# Altium schematic sheet ETH.SchDoc: LED Cube 8x8x8 - Ethernet
size A4; Author: Luka Penger; CompanyName: L. Penger; DrawnBy: Luka Penger; Organization: L. Penger; Address1: Luka Penger; Address2: http://lukapenger.eu; Address3: Software & Hardware; Address4: Development; DocumentNumber: 5; Revision: 4.0.0; SheetNumber: 5; SheetTotal: 5; DocumentName: ETH; ProjectName: LED Cube 8x8x8
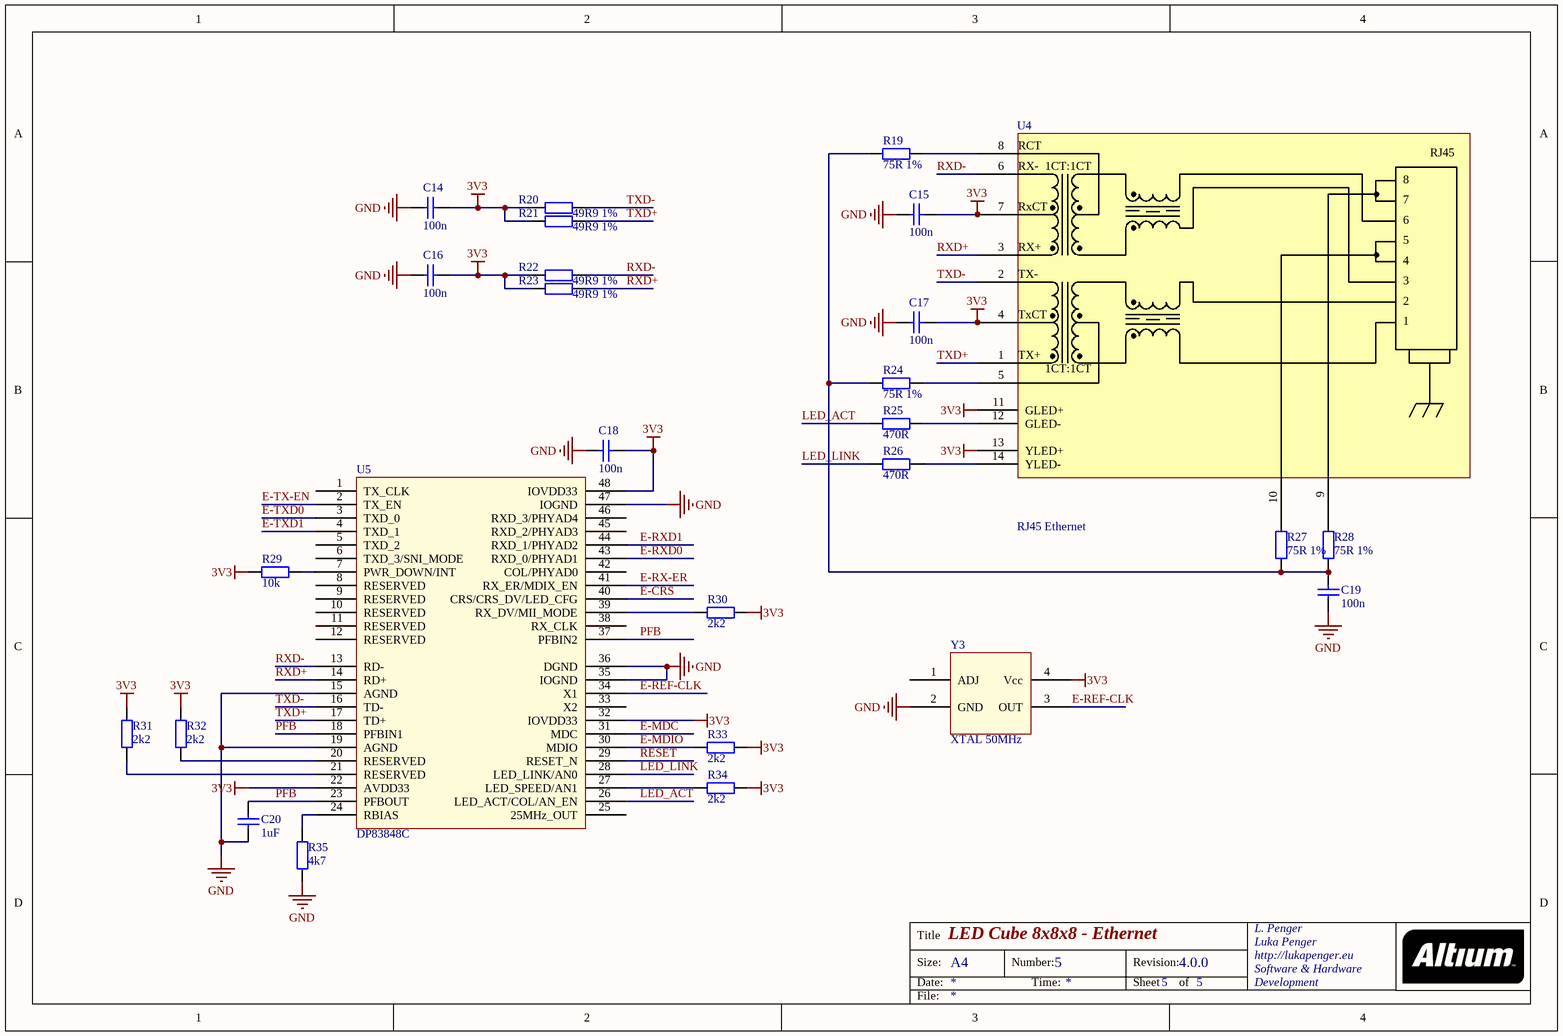
[diagram p0: ETH.SchDoc]

## Parts
C14  100n  [1608[0603]]
C15  100n  [1608[0603]]
C16  100n  [1608[0603]]
C17  100n  [1608[0603]]
C18  100n  [1608[0603]]
C19  100n  [1608[0603]]
C20  1uF  [6-0805_L]
R19  75R 1%  [1608[0603]]
R20  49R9 1%  [1608[0603]]
R21  49R9 1%  [1608[0603]]
R22  49R9 1%  [1608[0603]]
R23  49R9 1%  [1608[0603]]
R24  75R 1%  [1608[0603]]
R25  470R  [1608[0603]]
R26  470R  [1608[0603]]
R27  75R 1%  [1608[0603]]
R28  75R 1%  [1608[0603]]
R29  10k  [1608[0603]]
R30  2k2  [1608[0603]]
R31  2k2  [1608[0603]]
R32  2k2  [1608[0603]]
R33  2k2  [1608[0603]]
R34  2k2  [1608[0603]]
R35  4k7  [1608[0603]]
U4  RJ45 Ethernet  [RJ45 Ethernet connector]
U5  DP83848C  [DP83848C]
Y3  XTAL 50MHz  [XTAL ACT9200]

## Nets
3V3: C14.2 C15.2 C16.2 C17.2 C18.2 R20.2 R21.2 R22.2 R23.2 R29.2 R30.1 R31.1 R32.2 R33.1 R34.1 U4.4 U4.7 U4.11(GLED+) U4.13(YLED+) U5.22(AVDD33) U5.32(IOVDD33) U5.48(IOVDD33) Y3.4(Vcc)
GND: C14.1 C15.1 C16.1 C17.1 C18.1 C19.2 C20.2 R35.2 U5.15(AGND) U5.19(AGND) U5.35(IOGND) U5.36(DGND) U5.47(IOGND) Y3.2(GND)
E-CRS: U5.40(CRS/CRS_DV/LED_CFG)
E-MDC: U5.31(MDC)
E-MDIO: R33.2 U5.30(MDIO)
E-REF-CLK: U5.34(X1) Y3.3(OUT)
E-RX-ER: U5.41(RX_ER/MDIX_EN)
E-RXD0: U5.43(RXD_0/PHYAD1)
E-RXD1: U5.44(RXD_1/PHYAD2)
E-TX-EN: U5.2(TX_EN)
E-TXD0: U5.3(TXD_0)
E-TXD1: U5.4(TXD_1)
LED_ACT: R25.2 U5.26(LED_ACT/COL/AN_EN)
LED_LINK: R26.2 U5.28(LED_LINK/AN0)
PFB: C20.1 U5.18(PFBIN1) U5.23(PFBOUT) U5.37(PFBIN2)
RESET: U5.29(RESET_N)
RXD+: R23.1 U4.3 U5.14(RD+)
RXD-: R22.1 U4.6 U5.13(RD-)
TXD+: R21.1 U4.1 U5.17(TD+)
TXD-: R20.1 U4.2 U5.16(TD-)
NetC19_1: C19.1 R19.2 R24.2 R27.1 R28.1
NetR19_1: R19.1 U4.8
NetR24_1: R24.1 U4.5
NetR25_1: R25.1 U4.12(GLED-)
NetR26_1: R26.1 U4.14(YLED-)
NetR27_2: R27.2 U4.10
NetR28_2: R28.2 U4.9
NetR29_1: R29.1 U5.7(PWR_DOWN/INT)
NetR30_2: R30.2 U5.39(RX_DV/MII_MODE)
NetR31_2: R31.2 U5.21(RESERVED)
NetR32_1: R32.1 U5.20(RESERVED)
NetR34_2: R34.2 U5.27(LED_SPEED/AN1)
NetR35_1: R35.1 U5.24(RBIAS)

Not connected (* = marked no-connect by the designer): U5 1(TX_CLK) 5(TXD_2) 6(TXD_3/SNI_MODE) 8(RESERVED) 9(RESERVED) 10(RESERVED) 11(RESERVED) 12(RESERVED) 25(25MHz_OUT) 33(X2) 38(RX_CLK) 42(COL/PHYAD0) 45(RXD_2/PHYAD3) 46(RXD_3/PHYAD4); Y3 1(ADJ)

## Notes on the sheet
- Title
- Size:
- Date:
- A4
- Number:
- Time:
- Revision:
- Sheet
- of
- File:
- (in symbol RJ45 Ethernet) RCT; RJ45; RX-; 1CT:1CT; RxCT; RX+; TX-; TxCT; TX+

## Library data of the parts
C14-C20 = Cap: Capacitor; Value: 100pF; Published: 8-Jun-2000; LatestRevisionDate: 17-Jul-2002; LatestRevisionNote: Re-released for DXP Platform.; PackageReference: RAD-0.3; Publisher: Altium Limited; PackageDescription: Radial Cap, Thru-Hole; 2 Leads; 0.3 in Pin Spacing
R19-R35 = Res2: Resistor; Value: 1K; Published: 8-Jun-2000; LatestRevisionDate: 17-Jul-2002; LatestRevisionNote: Re-released for DXP Platform.; PackageReference: AXIAL-0.4; Publisher: Altium Limited; PackageDescription: Axial Device, Thru-Hole; 2 Leads; 0.4 in Pin Spacing
U4 = RJ45 Ethernet: Ethernet Connector
U5 = DP83848C: Ethernet PHY
Y3 = XTAL ACT9200